# EAGLE design miib (EAGLE 9.6.2)
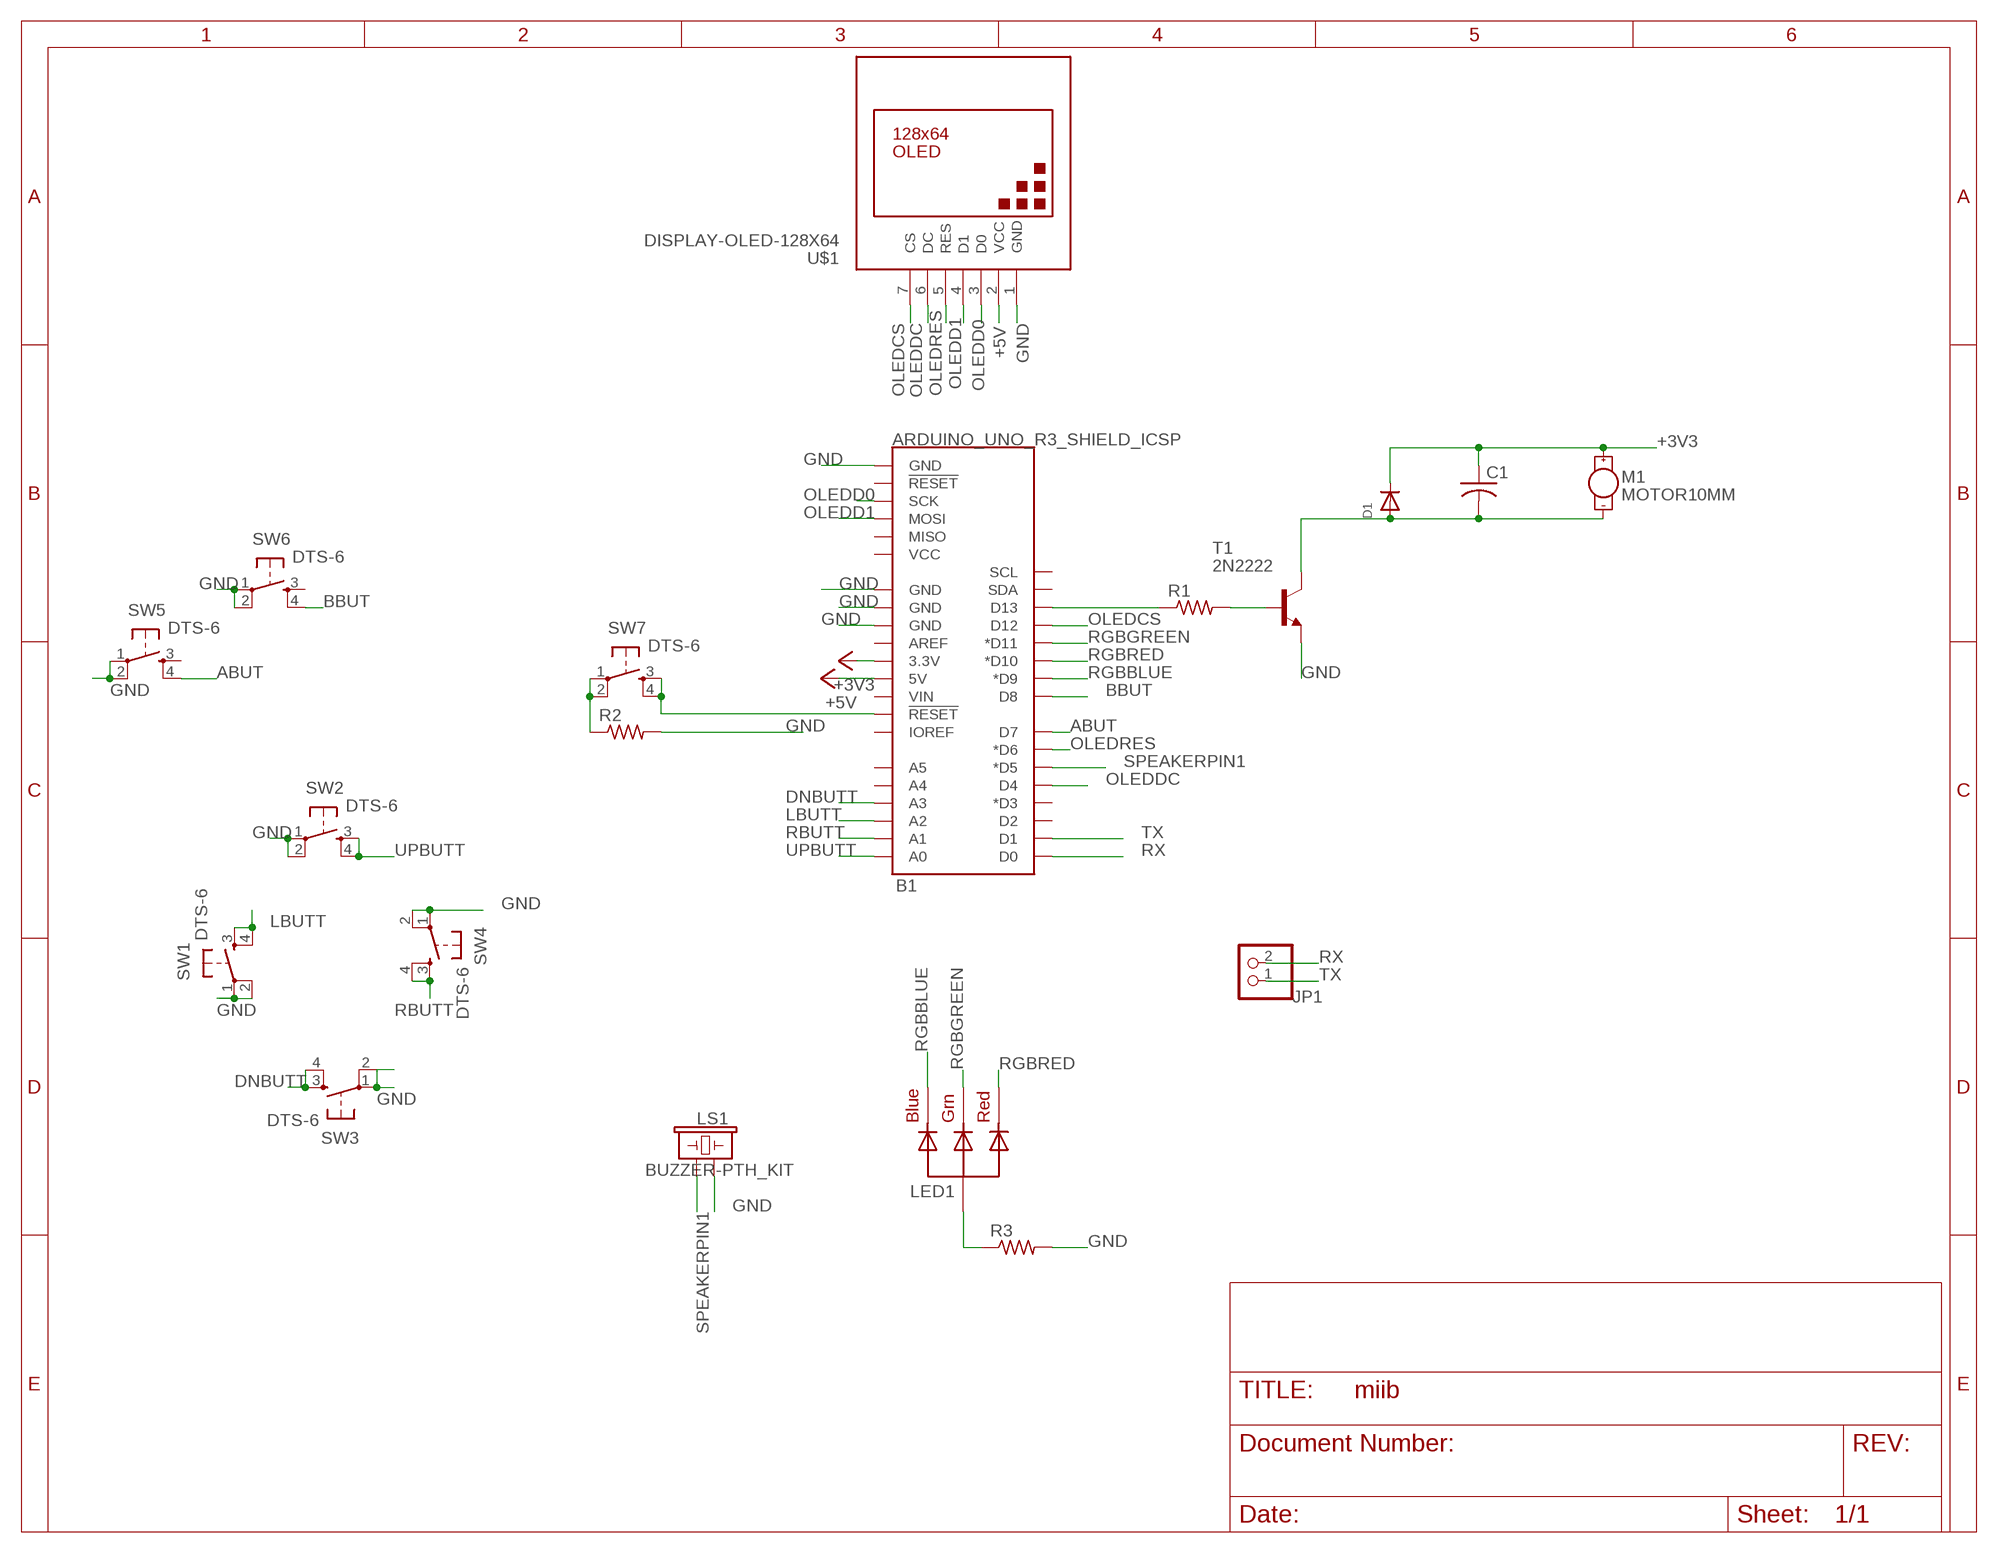
[diagram p0: schematic, sheet 1]

## Parts
B1  ARDUINO_UNO_R3_SHIELD_ICSP  [UNO_R3_SHIELD_ICSP]
C1  C-US025-025X050  [C025-025X050]
D1  DIODEDO-1N4148  [DO-1N4148]
JP1  PINHD-1X2/90  [1X02/90]
LED1  RGBLED_CA-5MM  [LED5MMRGB]
LS1  BUZZER-PTH_KIT  [BUZZER-12MM-KIT]
M1  MOTOR10MM  [VIBE-MOTOR-10MM]
R1  R-US_0204/7  [0204/7]
R2  R-US_0204/7  [0204/7]
R3  R-US_0204/7  [0204/7]
SW1  DTS-6  [DTS-6]
SW2  DTS-6  [DTS-6]
SW3  DTS-6  [DTS-6]
SW4  DTS-6  [DTS-6]
SW5  DTS-6  [DTS-6]
SW6  DTS-6  [DTS-6]
SW7  DTS-6  [DTS-6]
T1  2N2222  [TO92-EBC-OVAL]
U$1  DISPLAY-OLED-128X64  [DISPLAY-OLED-128X64]

## Nets
+3V3: B1.3.3V C1.1 D1.C M1.+
+5V: B1.5V U$1.2(VCC)
ABUT: B1.D7 SW5.4
BBUT: B1.D8 SW6.4
DNBUTT: B1.A3 SW3.3 SW3.4
GND: B1.GND@0(GND) B1.GND@1(GND) B1.GND@2(GND) B1.GND_ICSP(GND) LS1.- R2.2 R3.2 SW1.1 SW1.2 SW2.1 SW2.2 SW3.1 SW3.2 SW4.1 SW4.2 SW5.1 SW5.2 SW6.1 SW6.2 T1.E U$1.1(GND)
LBUTT: B1.A2 SW1.3 SW1.4
N$1: B1.D13 R1.1
N$2: R1.2 T1.B
N$3: R2.1 SW7.1 SW7.2
N$4: B1.RES(!RESET!) SW7.3 SW7.4
N$5: C1.2 D1.A M1.- T1.C
N$6: LED1.2(VCC) R3.1
OLEDCS: B1.D12 U$1.7(CS)
OLEDD0: B1.SCK U$1.3(D0)
OLEDD1: B1.MOSI U$1.4(D1)
OLEDDC: B1.D4 U$1.6(DC)
OLEDRES: B1.D6(*D6) U$1.5(RES)
RBUTT: B1.A1 SW4.3 SW4.4
RGBBLUE: B1.D9(*D9) LED1.4(BLUE)
RGBGREEN: B1.D11(*D11) LED1.3(GREEN)
RGBRED: B1.D10(*D10) LED1.1(RED)
RX: B1.RX(D0) JP1.2
SPEAKERPIN1: B1.D5(*D5) LS1.+
TX: B1.TX(D1) JP1.1
UPBUTT: B1.A0 SW2.3 SW2.4
Unconnected: B1.5V_ICSP(VCC) B1.A4 B1.A5 B1.AREF B1.D2 B1.D3(*D3) B1.IOREF B1.MISO B1.RST_ICSP(!RESET!) B1.SCL B1.SDA B1.VIN SW5.3 SW6.3

## Library data of the parts
B1 = NEWOLED:ARDUINO_UNO_R3_SHIELD_ICSP: Arduino R3 Shield Footprint with ICSP Header Includes pins for 6-pin (2x3) ICSP Header. Compatible with Leonardo boards that require SPI pin connections via this header. SparkFun Products: CryptoShield <https://www.sparkfun.com/products/13183> microSD Shield <https://www.sparkfun.com/products/12761> R3 Stackable Headers Kit <https://www.sparkfun.com/products/1417>
C1 = adafruit:C-US: CAPACITOR, American symbol
D1 = adafruit:DIODE: Diode SMADIODE - SMA Surface Mount Package 20V 1A Schottky Diode Digikey: 641-1014-6-ND DO-1N4148 - Through Hole Small Current Diode SOD-123 20V 1 A (.5mV Vf) Schottky Diode - Digikey: MBRX120TPMSCT-ND SOD-323 10V 570mA (.38mV Vf, 3ns) Schottky Diode - Digikey: ZLLS410CT-ND SOD-523 30V 30mA Schottky Diode (RB751S-40TE61) - Digikey: RB751S-40TE61CT-ND SOT23-R/W - SOT23 Package (R = Solder Paste/Reflow Ovens, W = Hand-Soldering) BAT54Film 40V 300mA - Digikey: 497-7162-1-ND
JP1 = pinhead:PINHD-1X2: PIN HEADER
LED1 = adafruit:RGBLED_CA: RGB LED, common-anode 5MM Staggered pins 5mm Piranha package http://www.ladyada.net/library/pcb/eaglelibrary.html
LS1 = SparkFun-Electromechanical:BUZZER: Buzzer Small round buzzers that operate around the audible 2kHz range. You can use these as speakers to create simple music or user interfaces. Variant Overview: PTH - Mini Speaker - PC Mount 12mm 2.048kHz <https://www.sparkfun.com/products/7950> PTH_KIT - Mini Speaker - PC Mount 12mm 2.048kHz <https://www.sparkfun.com/products/7950> KIT simplifies soldering by adding stop mask to one side of the pads. PTH_NO_SILK - Mini Speaker - PC Mount 12mm 2.048kHz <https://www.sparkfun.com/products/7950> No silkscreen indicator of buzzer outline. PTH_KIT_NO_SILK - Mini Speaker - PC Mount 12mm 2.048kHz <https://www.sparkfun.com/products/7950> KIT package w/o silkscreen SMD - Buzzer Audio Magnetic (CCV-084B16) SMD buzzer used on, e.g. the LilyPad Buzzer <https://www.sparkfun.com/products/8463> and RFID USB Reader <https://www.sparkfun.com/products/9963>. SMD_KIT - Buzzer Audio Magnetic (CCV-084B16) SMD Buzzer with elongated pins to make soldering easier. Used on the SparkFun Simon Says - Surface Mount Soldering Kit <https://www.sparkfun.com/products/10935>.; PROD_ID: COMP-08253; SF_SKU: COM-07950
M1 = SparkFun-Electromechanical:MOTOR: Motor (Single-Phase) Two-terminal, single-phase motors. SparkFun Products Vibration Motor <https://www.sparkfun.com/products/8449> (ROB-08449) Physical dimension and wire connections for this powerful vibration motor. Motor has a self adhesive backing.; PROD_ID: COMP-08572; SF_SKU: ROB-08449
R1-R3 = adafruit:R-US_: RESISTOR, American symbol
SW1-SW7 = switch-tact:DTS-6
T1 = adafruit:2N2222: NPN TRANSISTOR Big oval pads
U$1 = NEWOLED:DISPLAY-OLED-128X64: 128x64 Dot Matrix OLED Module based on SSD1306 chip Variant with SPI interface More details available here: http://www.instructables.com/id/How-to-use-OLED-display-arduino-module/ SSD1306 datasheet: https://cdn-shop.adafruit.com/datasheets/SSD1306.pdf Click here to find device on ebay.com <http://www.ebay.com/sch/oled+display+128x64> Note: There are two variants: I2C and SPI. Search for the proper version.

## Board
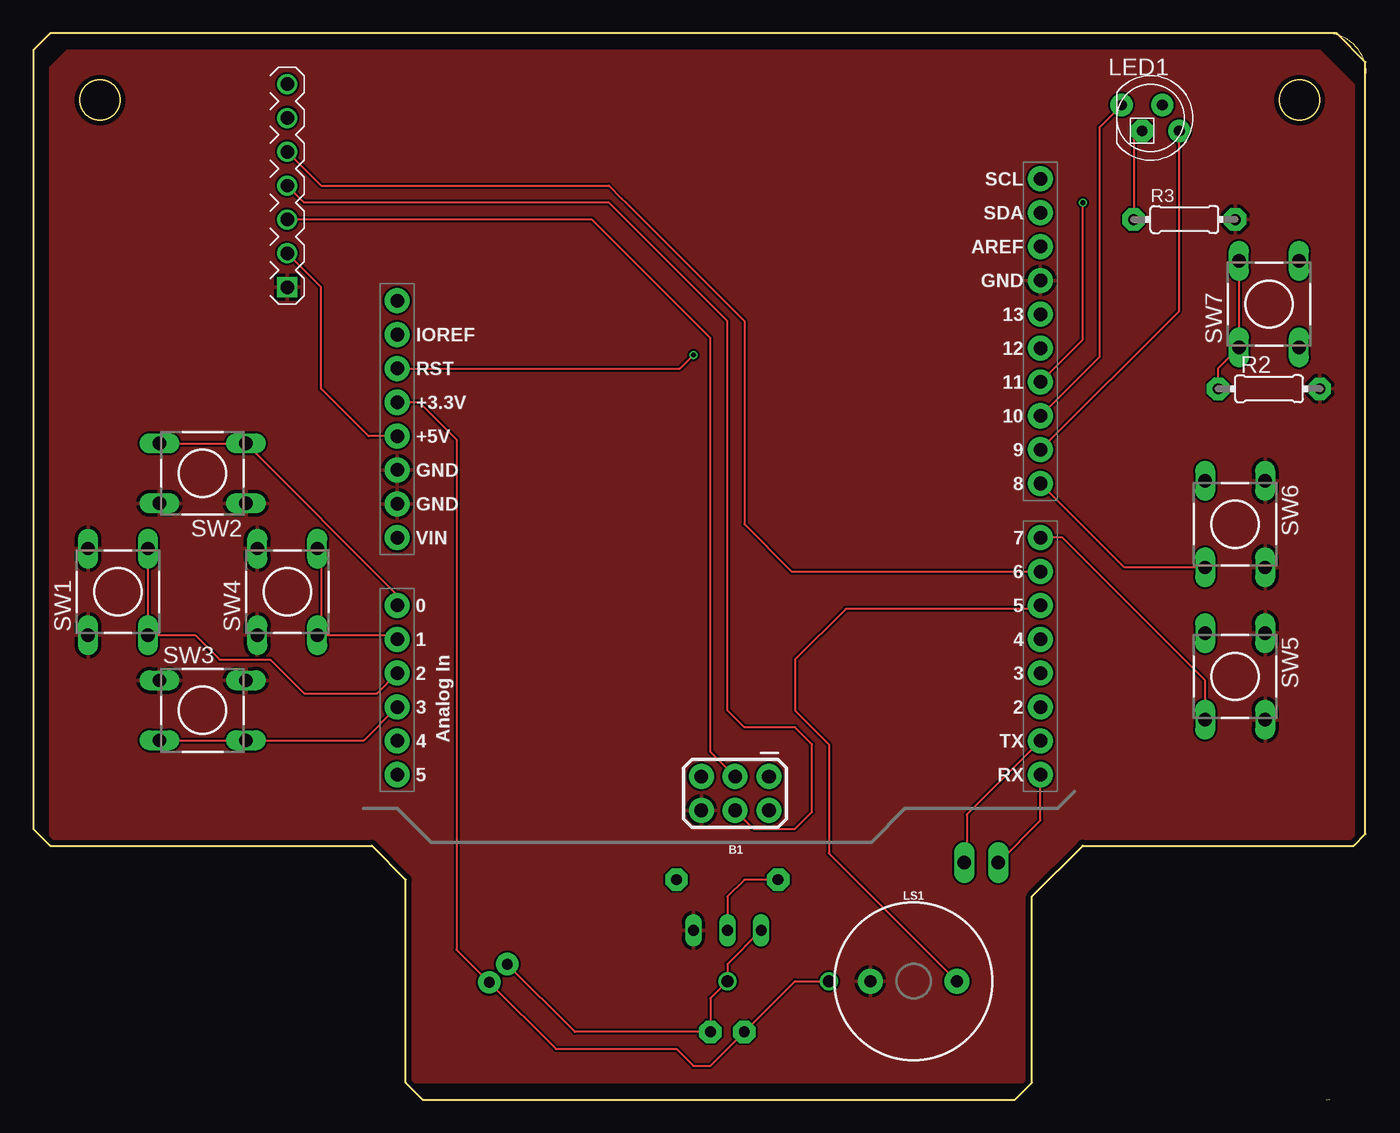
[diagram p1: board, top side]
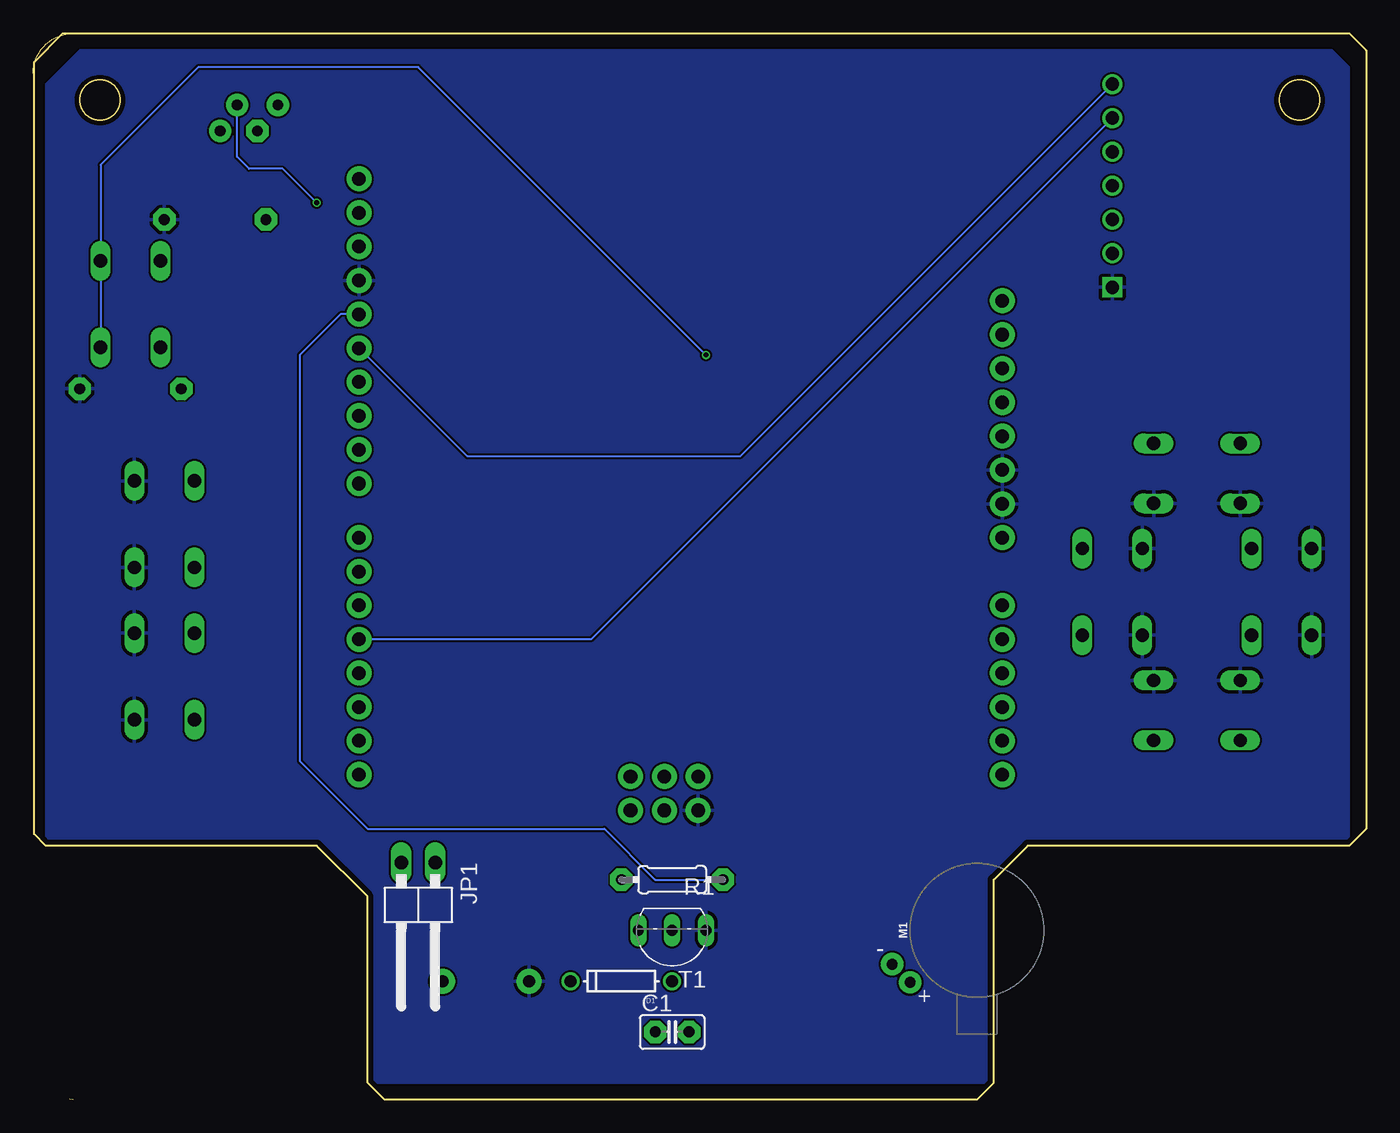
[diagram p2: board, bottom side, seen from below]

Size 100 x 80.01 mm. Coordinates in mm from the lower left corner, seen from the top.
Outline: 97,0 97.26,0.01
Outline: 100,77 99.99,77.26 arc85 97,80 3,80 2.74,79.99
Outline: 1.27,19.05 25.4,19.05 27.94,16.51 27.94,1.27 29.21,0 73.66,0 74.93,1.27 74.93,15.24 78.74,19.05 99.06,19.05 99.95,19.94 99.95,77.85 97.79,80.01 1.27,80.01 0,78.74 0,20.32 1.27,19.05
Outline: circle at 95,75 radius 1.5
Outline: circle at 5,75 radius 1.5
Copper layers (1*16): Top 0.035559375mm / dielectric 1.6mm / Bottom 0.035559375mm
Design rules "oshpark-2layer": minimum track width 6mil, minimum drill 10mil, track to track 6mil, track to pad 6mil, pad to pad 6mil, via to via 6mil, smd to smd 6mil, copper to edge 15mil, drill to drill 6mil, minimum pad ring 5mil, minimum via ring 5mil, stop-mask expansion 2.5mil, vias tented up to drill 0mil, thermal gap 10mil

### Footprints (pad centres in the part's own frame; a part is rotated, then mirrored left to right if it is on the bottom)
UNO_R3_SHIELD_ICSP = drill 1.016 pad 1.88: 3.3V 24.13,-3.81; 5V 24.13,-1.27; 5V_ICSP -3.76,26.81; A0 24.13,11.43; A1 24.13,13.97; A2 24.13,16.51; A3 24.13,19.05; A4 24.13,21.59; A5 24.13,24.13; AREF -24.13,-15.494; D2 -24.13,19.05; D3 -24.13,16.51; D4 -24.13,13.97; D5 -24.13,11.43; D6 -24.13,8.89; D7 -24.13,6.35; D8 -24.13,2.286; D9 -24.13,-0.254; D10 -24.13,-2.794; D11 -24.13,-5.334; D12 -24.13,-7.874; D13 -24.13,-10.414; GND@0 24.13,1.27; GND@1 24.13,3.81; GND@2 -24.13,-12.954; GND_ICSP 1.32,26.81; IOREF 24.13,-8.89; MISO -3.76,24.27; MOSI -1.22,26.81; NC 24.13,-11.43; RES 24.13,-6.35; RST_ICSP 1.32,24.27; RX -24.13,24.13; SCK -1.22,24.27; SCL -24.13,-20.574; SDA -24.13,-18.034; TX -24.13,21.59; VIN 24.13,6.35
C025-025X050 = drill 0.813 pad 1.676 octagon: 1 -1.27,0; 2 1.27,0
DO-1N4148 = drill 0.9: A -3.81,0; C 3.81,0
1X02/90 = drill 1.016 long: 1 -1.27,-3.81; 2 1.27,-3.81
LED5MMRGB = drill 0.8 pad 1.676: 1 -2.159,0.968; 3 0.889,0.968; 4 2.159,-0.968 | drill 0.8 pad 1.676 octagon: 2 -0.635,-0.968
BUZZER-12MM-KIT = drill 0.9 pad 1.88: + 3.25,0; - -3.25,0
VIBE-MOTOR-10MM = drill 0.8 pad 1.676: + -5,-3.9; - -6.35,-2.54
0204/7 = drill 0.813 pad 1.676 octagon: 1 -3.81,0; 2 3.81,0
DTS-6 = drill 1 long: 1 -3.25,2.25; 2 3.25,2.25; 3 -3.25,-2.25; 4 3.25,-2.25
TO92-EBC-OVAL = drill 0.813 long: B 0,-1.27; C 2.54,-1.27; E -2.54,-1.27
DISPLAY-OLED-128X64 = drill 1 square: 1 -7.62,12.7 | drill 1: 2 -5.08,12.7; 3 -2.54,12.7; 4 0,12.7; 5 2.54,12.7; 6 5.08,12.7; 7 7.62,12.7

### Placement (x,y rotation side)
B1  51.44,48.51 180 top
C1  52.07,5.08 0 bottom
D1  55.88,8.89 180 bottom
JP1  71.12,13.97 180 bottom
LED1  83.82,73.66 0 top
LS1  66.04,8.89 0 top
M1  29.21,12.7 0 bottom
R1  52.07,16.51 180 bottom
R2  92.71,53.34 0 top
R3  86.36,66.04 0 top
SW1  6.35,38.1 90 top
SW2  12.7,46.99 180 top
SW3  12.7,29.21 0 top
SW4  19.05,38.1 90 top
SW5  90.17,31.75 270 top
SW6  90.17,43.18 270 top
SW7  92.71,59.69 90 top
T1  52.07,11.43 180 bottom
U$1  31.75,68.58 90 top

### Tracks (layer width: path | path; a pad name or v marks a point on that pad's centre or on a via)
+3V3
  Top 0.152: B1.3.3V 28.96,52.32 31.75,49.53 31.75,11.26 M1.+ 39.2,3.81 48.26,3.81 49.53,2.54 50.8,2.54 C1.1 57.15,8.89 D1.C
+5V
  Top 0.152: B1.5V 25.15,49.78 21.59,53.34 21.59,60.96 U$1.2
ABUT
  Top 0.152: SW5.4 87.92,31.46 77.22,42.16 B1.D7
BBUT
  Top 0.152: SW6.4 81.86,39.93 B1.D8
DNBUTT
  Top 0.152: SW3.3 SW3.4 24.8,26.96 B1.A3
GND
  pour Top (isolate 0): 2.54,78.74 96.52,78.74 97.79,77.47 99.06,76.2 99.06,59.69 99.06,2.54 97.79,1.27 96.52,1.27 2.54,1.27 1.27,2.54 1.27,12.7 1.27,77.47
  pour Bottom (isolate 0): 2.54,78.74 96.52,78.74 99.06,76.2 99.06,31.75 99.06,2.54 97.79,1.27 2.54,1.27 1.27,2.54 1.27,77.47
LBUTT
  Top 0.152: SW1.4 SW1.3 12.14,34.85 13.97,33.02 17.78,33.02 20.32,30.48 25.78,30.48 B1.A2
N$1
  Bottom 0.152: B1.D13 76.96,58.93 80.01,55.88 80.01,25.4 74.93,20.32 57.15,20.32 53.34,16.51 R1.1
N$2
  Top 0.152: R1.2 53.34,16.51 52.07,15.24 T1.B
N$3
  Top 0.152: R2.1 88.9,54.88 90.03,56.02 SW7.1 SW7.2
N$4  (via drill 0.35)
  Top 0.152: B1.RES 48.51,54.86 v49.53,55.88
  Bottom 0.152: v49.53,55.88 71.12,77.47 87.63,77.47 94.96,70.14 SW7.4 SW7.3
N$5
  Top 0.152: T1.C 52.07,10.16 D1.A 50.8,7.62 C1.2 40.64,5.08 M1.-
N$6
  Top 0.152: LED1.2 82.55,72.06 R3.1
OLEDCS
  Bottom 0.152: U$1.7 46.99,48.26 67.44,48.26 B1.D12
OLEDD0
  Top 0.152: B1.SCK 50.8,26.1 50.8,57.15 41.91,66.04 U$1.3
OLEDD1
  Top 0.152: B1.MOSI 54.04,20.32 57.15,20.32 58.42,21.59 58.42,26.67 57.15,27.94 53.34,27.94 52.07,29.21 52.07,58.42 43.18,67.31 20.32,67.31 U$1.4
OLEDDC
  Bottom 0.152: B1.D4 58.17,34.54 U$1.6
OLEDRES
  Top 0.152: B1.D6 56.9,39.62 53.34,43.18 53.34,58.42 44.45,67.31 44.15,67.61 43.18,68.58 21.59,68.58 U$1.5
RBUTT
  Top 0.152: SW4.3 21.59,34.85 | 21.59,34.85 27,34.85 B1.A1 | SW4.4 21.59,41.06 21.59,34.85
RGBBLUE
  Top 0.152: B1.D9 85.98,59.18 LED1.4
RGBGREEN  (via drill 0.35)
  Top 0.152: B1.D11 78.74,57.02 v78.74,67.31
  Bottom 0.152: v78.74,67.31 81.28,69.85 83.82,69.85 84.71,70.74 LED1.3
RGBRED
  Top 0.152: B1.D10 80.01,55.75 80.01,72.98 LED1.1
RX
  Top 0.152: B1.RX 75.56,20.95 JP1.2
SPEAKERPIN1
  Top 0.152: B1.D5 75.31,36.83 60.96,36.83 57.15,33.02 57.15,29.21 59.69,26.67 59.69,18.49 LS1.+
TX
  Top 0.152: B1.TX 70.04,21.4 70.04,17.97 JP1.1
UPBUTT
  Top 0.152: B1.A0 27.3,37.88 SW2.3 SW2.4